# Altium schematic sheet DUT.SchDoc
size A4; PageSetup: Record=PageOptions|CenterHorizontal=True|CenterVertical=True|PrintScale=0.97|XCorrection=1.00|YCorrection=1.00|PrintKind=2|BorderSize=5000000|LeftOffset=0|BottomOffset=0|Orientation=2|PaperLength=1000|PaperWidth=1000|Scale=100|PaperSource=7|PrintQuality=-4|MediaType=1|DitherType=10|PaperKind=A4|PrintScaleMode=1
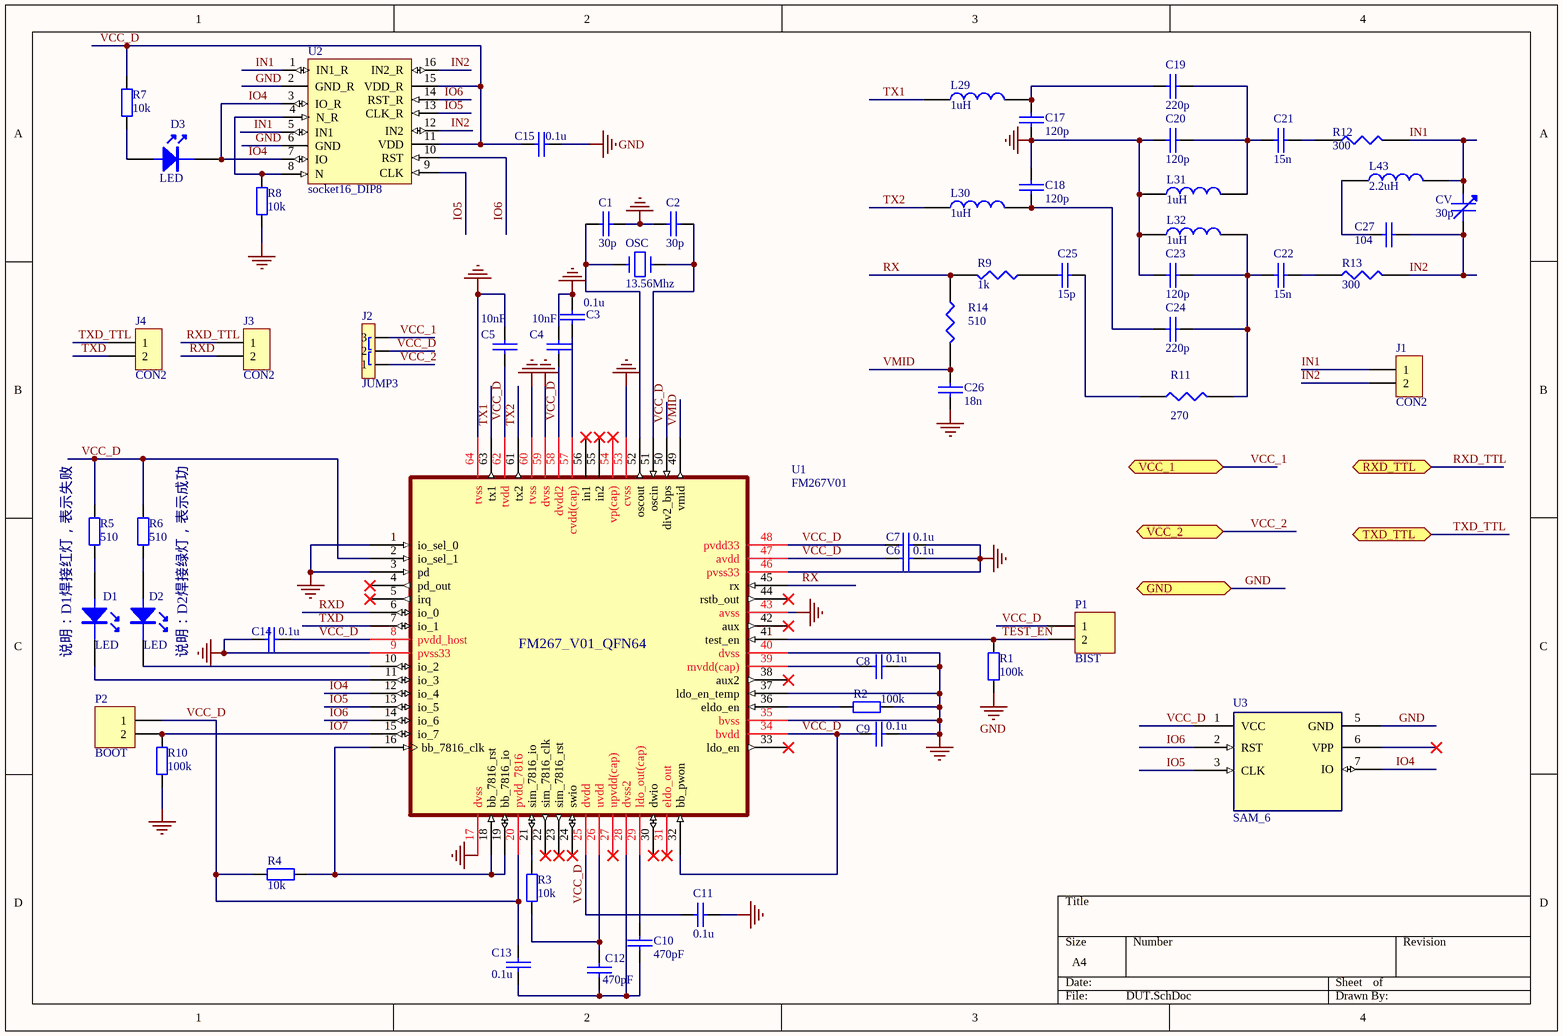
[diagram p0: DUT.SchDoc]

## Parts
C1  30p  [0805]
C2  30p  [0805]
C3  0.1u  [0805]
C4  10nF  [0805]
C5  10nF  [0805]
C6  0.1u  [0805]
C7  0.1u  [0805]
C8  0.1u  [0805]
C9  0.1u  [0805]
C10  470pF  [0805]
C11  0.1u  [0805]
C12  470pF  [0805]
C13  0.1u  [0805]
C14  0.1u  [0805]
C15  0.1u  [0805]
C17  120p  [0805]
C18  120p  [0805]
C19  220p  [0805]
C20  120p  [0805]
C21  15n  [0805]
C22  15n  [0805]
C23  120p  [0805]
C24  220p  [0805]
C25  15p  [0805]
C26  18n  [0805]
C27  104  [0805]
CV  30p  [0805]
D1  LED  [0805]
D2  LED  [0805]
D3  LED  [0805]
J1  CON2  [SIP2]
J2  JUMP3  [SIP3]
J3  CON2  [SIP2]
J4  CON2  [SIP2]
L29  1uH  [0805]
L30  1uH  [0805]
L31  1uH  [0805]
L32  1uH  [0805]
L43  2.2uH  [0805]
OSC  13.56Mhz  [XTAL-RAD0.2]
P1  BIST  [HDR1X2]
P2  BOOT  [HDR1X2]
R1  100k  [0805]
R2  100k  [0805]
R3  10k  [0805]
R4  10k  [0805]
R5  510  [0805]
R6  510  [0805]
R7  10k  [0805]
R8  10k  [0805]
R9  1k  [0805]
R10  100k  [0805]
R11  270  [0805]
R12  300  [0805]
R13  300  [0805]
R14  510  [0805]
U1  FM267V01  [QFN64]
U2  socket16_DIP8  [SOP16_DIP16_SOCKET]
U3  SAM_6  [SAM-6]

## Ports
GND, RXD_TTL (bidir), TXD_TTL (bidir), VCC_1, VCC_2

## Nets
GND: C1.1 C2.2 C3.2 C4.2 C5.2 C6.2 C7.2 C8.2 C9.2 C11.1 C14.1 C15.1 C17.1 C18.2 C20.1 C23.1 C26.1 L31.1 L32.1 R1.1 R2.1 R8.1 R10.1 U1.1(io_sel_0) U1.3(pd) U1.9(pvss33) U1.17(dvss) U1.35(bvss) U1.37(ldo_en_temp) U1.40(dvss) U1.43(avss) U1.46(pvss33) U1.53(cvss) U1.59(dvss) U1.60(tvss) U1.64(tvss) U2.2(GND_R) U2.6(GND) U3.5(GND) ; port GND
IN1: CV.1 J1.1 L43.2 R12.2 U2.1(IN1_R) U2.5(IN1)
IN2: C27.2 CV.2 J1.2 R13.2 U2.12(IN2) U2.16(IN2_R)
IO4: D3.2(K) U1.12(io_4) U2.3(IO_R) U2.7(IO) U3.7(IO)
IO5: U1.13(io_5) U2.9(CLK) U2.13(CLK_R) U3.3(CLK)
IO6: U1.14(io_6) U2.10(RST) U2.14(RST_R) U3.2(RST)
IO7: P2.2 R10.2 U1.15(io_7)
RX: R9.2 R14.1 U1.45(rx)
RXD: J3.2 U1.6(io_0)
RXD_TTL: J3.1 ; port RXD_TTL
TEST_EN: P1.2 R1.2 U1.41(test_en)
TX1: L29.1 U1.63(tx1)
TX2: L30.1 U1.61(tx2)
TXD: J4.2 U1.7(io_1)
TXD_TTL: J4.1 ; port TXD_TTL
VCC_1: J2.3 ; port VCC_1
VCC_2: J2.1 ; port VCC_2
VCC_D: C4.1 C5.1 C6.1 C7.1 C9.1 C11.2 C13.2 C14.2 C15.2 J2.2 P1.1 P2.1 R4.1 R5.1 R6.1 R7.1 U1.2(io_sel_1) U1.8(pvdd_host) U1.20(pvdd_7816) U1.25(dvdd) U1.32(bb_pwon) U1.34(bvdd) U1.47(avdd) U1.48(pvdd33) U1.50(div2_bps) U1.58(dvdd2) U1.62(tvdd) U2.11(VDD) U2.15(VDD_R) U3.1(VCC)
VMID: C26.2 R14.2 U1.49(vmid)
NetC1_2: C1.2 OSC.1 U1.52(oscout)
NetC2_1: C2.1 OSC.2 U1.51(oscin)
NetC3_1: C3.1 U1.57(cvdd(cap))
NetC8_1: C8.1 U1.39(mvdd(cap))
NetC10_1: C10.1 C12.2 C13.1 U1.28(dvss2)
NetC10_2: C10.2 U1.29(ldo_out(cap))
NetC12_1: C12.1 R3.2 U1.26(uvdd)
NetC17_2: C17.2 C19.1 L29.2
NetC18_1: C18.1 C24.1 L30.2
NetC19_2: C19.2 C20.2 C21.2 L31.2
NetC21_1: C21.1 R12.1
NetC22_1: C22.1 R13.1
NetC22_2: C22.2 C23.2 C24.2 L32.2 R11.2
NetC25_1: C25.1 R9.1
NetC25_2: C25.2 R11.1
NetC27_1: C27.1 L43.1
NetD1_1: D1.1(A) R5.2
NetD1_2: D1.2(K) U1.11(io_3)
NetD2_1: D2.1(A) R6.2
NetD2_2: D2.2(K) U1.10(io_2)
NetD3_1: D3.1(A) R7.2
NetR2_2: R2.2 U1.36(eldo_en)
NetR3_1: R3.1 U1.21(sim_7816_io)
NetR4_2: R4.2 U1.16(bb_7816_clk) U1.18(bb_7816_rst) U1.19(bb_7816_io)
NetR8_2: R8.2 U2.4(N_R) U2.8(N)

Not connected (* = marked no-connect by the designer): U1 4(pd_out)* 5(irq)* 22(sim_7816_clk)* 23(sim_7816_rst)* 24(swio)* 27(upvdd(cap))* 30(dwio)* 31(eldo_out)* 33(ldo_en)* 38(aux2)* 42(aux)* 44(rstb_out)* 54(vp(cap))* 55(in2)* 56(in1)*; U3 6(VPP)*

## Notes on the sheet
- 说明：D1焊接红灯，表示失败
- 说明：D2焊接绿灯，表示成功
- (in symbol FM267V01_QFN64) FM267_V01_QFN64

## Library data of the parts
C1 C2 C17-C27 = CAP: Capacitor
C3-C15 = CAP
CV = CAPVAR: Variable Capacitor
J1 J3 J4 = CON2: Connector
J2 = JUMP3: 2选1跳线（短路）连接器，一般使用SIP3即可
L29-L32 L43 = INDUCTOR
OSC = CRYSTAL
P1 P2 = Header 2: Header, 2-Pin; LatestRevisionDate: 17-Jul-2002; LatestRevisionNote: Re-released for DXP Platform.; Publisher: Altium Limited
R1-R8 R10 = Res2: Resistor; Published: 8-Jun-2000; LatestRevisionDate: 17-Jul-2002; LatestRevisionNote: Re-released for DXP Platform.; PackageReference: AXIAL-0.4; Publisher: Altium Limited
  R1 R2 R10: Value: 100k
  R3 R4 R7 R8: Value: 10k
  R5 R6: Value: 510
R9 R11-R14 = RES1
U1 = FM267V01_QFN64